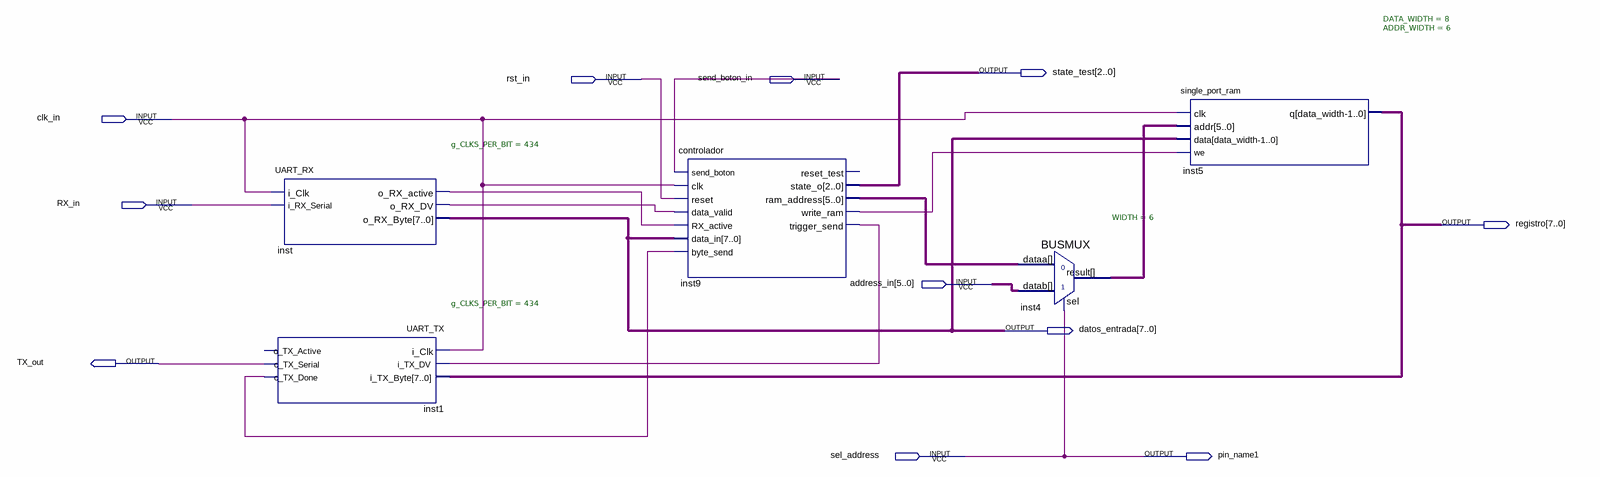
[diagram p0: schematic sheet]
// Quartus schematic controlador_main.bdf as structural Verilog: 5 symbols, 11 pins
module controlador_main (
  input  rst_in,
  input  send_boton_in,
  input  clk_in,
  input  RX_in,
  input  [5:0] address_in,
  input  sel_address,
  output [2:0] state_test,
  output [7:0] registro,
  output [7:0] datos_entrada,
  output TX_out,
  output pin_name1
);

  wire inst1_o_tx_done, inst9_trigger_send, inst9_write_ram, inst_o_rx_active, inst_o_rx_dv;
  wire [5:0] inst4_result, inst9_ram_address;

  UART_RX #(.g_CLKS_PER_BIT(434)) inst (
    .i_Clk(clk_in), .i_RX_Serial(RX_in), .o_RX_active(inst_o_rx_active), .o_RX_DV(inst_o_rx_dv),
    .o_RX_Byte(datos_entrada));
  UART_TX #(.g_CLKS_PER_BIT(434)) inst1 (
    .i_Clk(clk_in), .i_TX_DV(inst9_trigger_send), .i_TX_Byte(registro), .o_TX_Serial(TX_out),
    .o_TX_Done(inst1_o_tx_done));  // open: o_TX_Active
  controlador inst9 (
    .send_boton(send_boton_in), .clk(clk_in), .reset(rst_in), .data_valid(inst_o_rx_dv),
    .RX_active(inst_o_rx_active), .data_in(datos_entrada), .byte_send(inst1_o_tx_done), .state_o(state_test),
    .ram_address(inst9_ram_address), .write_ram(inst9_write_ram), .trigger_send(inst9_trigger_send));  // open: reset_test
  BUSMUX #(.WIDTH(6)) inst4 (.datab(address_in), .sel(sel_address), .dataa(inst9_ram_address), .result(inst4_result));
  single_port_ram #(.DATA_WIDTH(8), .ADDR_WIDTH(6)) inst5 (
    .clk(clk_in), .addr(inst4_result), .data(datos_entrada), .we(inst9_write_ram), .q(registro));

  assign pin_name1 = sel_address;
endmodule
